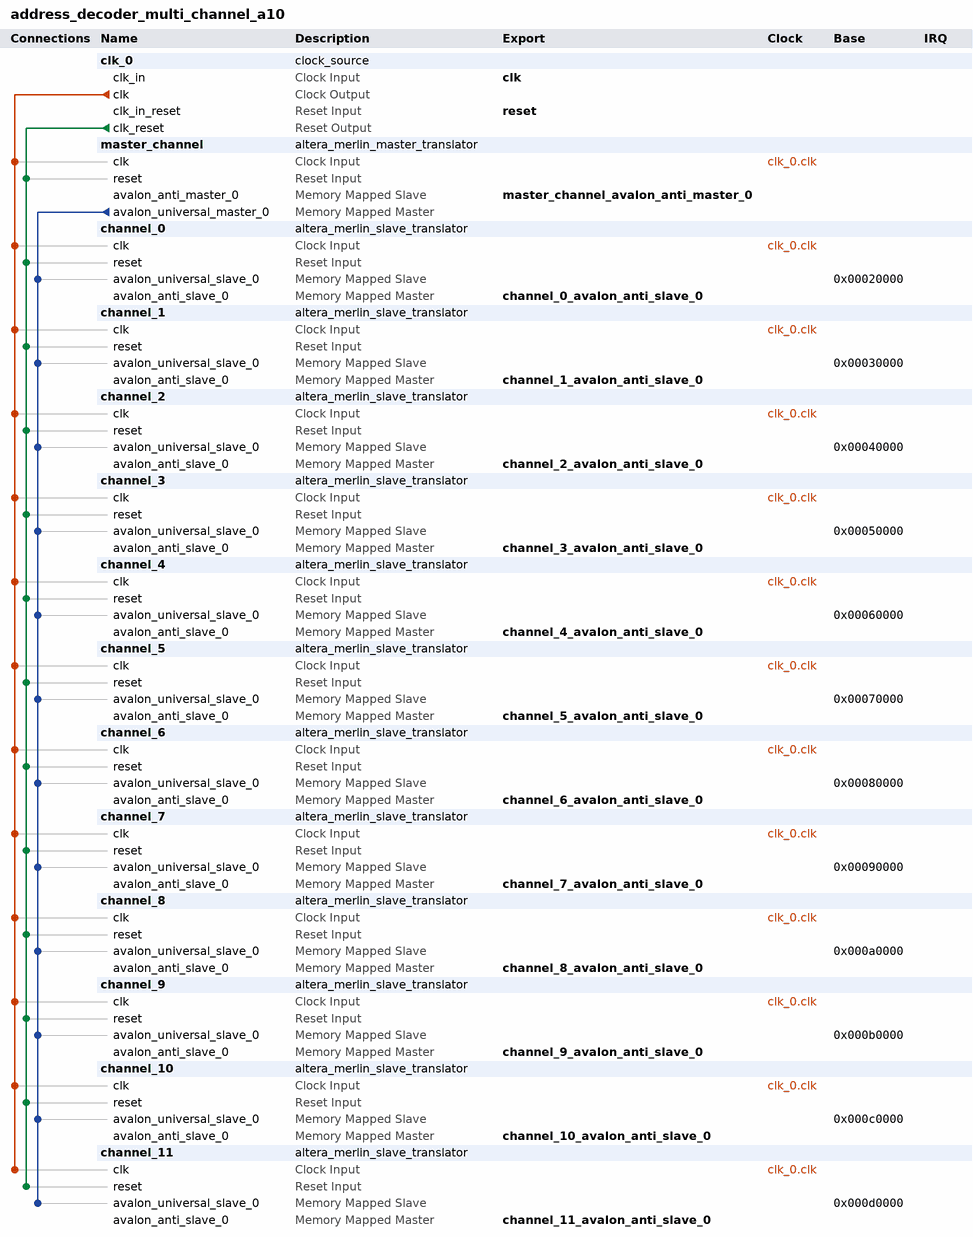
[diagram p0: system contents]
# Platform Designer (Qsys) system address_decoder_multi_channel_a10, Arria 10 10AX115S4F45I3SGE2
# Parameters at their usual value, and those the tool derives, are not listed.
package require -exact qsys 15.0
create_system address_decoder_multi_channel_a10
set_project_property DEVICE_FAMILY {Arria 10}
set_project_property DEVICE 10AX115S4F45I3SGE2

add_instance clk_0 clock_source 15.0
set_instance_parameter_value clk_0 clockFrequency 100000000

add_instance master_channel altera_merlin_master_translator 15.0
set_instance_parameter_value master_channel AV_ADDRESSGROUP 0
set_instance_parameter_value master_channel AV_ADDRESS_SYMBOLS 1
set_instance_parameter_value master_channel AV_ADDRESS_W 20
set_instance_parameter_value master_channel AV_ALWAYSBURSTMAXBURST 0
set_instance_parameter_value master_channel AV_BITS_PER_SYMBOL 8
set_instance_parameter_value master_channel AV_BURSTBOUNDARIES 0
set_instance_parameter_value master_channel AV_BURSTCOUNT_SYMBOLS 1
set_instance_parameter_value master_channel AV_BURSTCOUNT_W 3
set_instance_parameter_value master_channel AV_BYTEENABLE_W 4
set_instance_parameter_value master_channel AV_CONSTANT_BURST_BEHAVIOR 0
set_instance_parameter_value master_channel AV_DATA_HOLD 0
set_instance_parameter_value master_channel AV_DATA_W 32
set_instance_parameter_value master_channel AV_INTERLEAVEBURSTS 0
set_instance_parameter_value master_channel AV_ISBIGENDIAN 0
set_instance_parameter_value master_channel AV_LINEWRAPBURSTS 0
set_instance_parameter_value master_channel AV_MAX_PENDING_READ_TRANSACTIONS 0
set_instance_parameter_value master_channel AV_READLATENCY 0
set_instance_parameter_value master_channel AV_READ_WAIT 0
set_instance_parameter_value master_channel AV_REGISTERINCOMINGSIGNALS 0
set_instance_parameter_value master_channel AV_REGISTEROUTGOINGSIGNALS 0
set_instance_parameter_value master_channel AV_SETUP_WAIT 0
set_instance_parameter_value master_channel AV_SYMBOLS_PER_WORD 4
set_instance_parameter_value master_channel AV_WRITE_WAIT 0
set_instance_parameter_value master_channel UAV_ADDRESSGROUP 0
set_instance_parameter_value master_channel UAV_ADDRESS_W 32
set_instance_parameter_value master_channel UAV_BURSTCOUNT_W 3
set_instance_parameter_value master_channel UAV_CONSTANT_BURST_BEHAVIOR 0
set_instance_parameter_value master_channel USE_ADDRESS 1
set_instance_parameter_value master_channel USE_BEGINBURSTTRANSFER 0
set_instance_parameter_value master_channel USE_BEGINTRANSFER 0
set_instance_parameter_value master_channel USE_BURSTCOUNT 0
set_instance_parameter_value master_channel USE_BYTEENABLE 0
set_instance_parameter_value master_channel USE_CHIPSELECT 0
set_instance_parameter_value master_channel USE_CLKEN 0
set_instance_parameter_value master_channel USE_DEBUGACCESS 0
set_instance_parameter_value master_channel USE_LOCK 0
set_instance_parameter_value master_channel USE_READ 1
set_instance_parameter_value master_channel USE_READDATA 1
set_instance_parameter_value master_channel USE_READDATAVALID 0
set_instance_parameter_value master_channel USE_READRESPONSE 0
set_instance_parameter_value master_channel USE_WAITREQUEST 1
set_instance_parameter_value master_channel USE_WRITE 1
set_instance_parameter_value master_channel USE_WRITEDATA 1
set_instance_parameter_value master_channel USE_WRITERESPONSE 0

add_instance channel_0 altera_merlin_slave_translator 15.0
set_instance_parameter_value channel_0 AV_ADDRESSGROUP 0
set_instance_parameter_value channel_0 AV_ADDRESS_SYMBOLS 1
set_instance_parameter_value channel_0 AV_ADDRESS_W 16
set_instance_parameter_value channel_0 AV_ALWAYSBURSTMAXBURST 0
set_instance_parameter_value channel_0 AV_BITS_PER_SYMBOL 8
set_instance_parameter_value channel_0 AV_BURSTBOUNDARIES 0
set_instance_parameter_value channel_0 AV_BURSTCOUNT_SYMBOLS 1
set_instance_parameter_value channel_0 AV_BURSTCOUNT_W 1
set_instance_parameter_value channel_0 AV_BYTEENABLE_W 4
set_instance_parameter_value channel_0 AV_CONSTANT_BURST_BEHAVIOR 0
set_instance_parameter_value channel_0 AV_DATA_HOLD 0
set_instance_parameter_value channel_0 AV_DATA_W 32
set_instance_parameter_value channel_0 AV_INTERLEAVEBURSTS 0
set_instance_parameter_value channel_0 AV_ISBIGENDIAN 0
set_instance_parameter_value channel_0 AV_LINEWRAPBURSTS 0
set_instance_parameter_value channel_0 AV_MAX_PENDING_READ_TRANSACTIONS 1
set_instance_parameter_value channel_0 AV_MAX_PENDING_WRITE_TRANSACTIONS 0
set_instance_parameter_value channel_0 AV_READLATENCY 0
set_instance_parameter_value channel_0 AV_READ_WAIT 0
set_instance_parameter_value channel_0 AV_REGISTERINCOMINGSIGNALS 0
set_instance_parameter_value channel_0 AV_REGISTEROUTGOINGSIGNALS 0
set_instance_parameter_value channel_0 AV_REQUIRE_UNALIGNED_ADDRESSES 0
set_instance_parameter_value channel_0 AV_SETUP_WAIT 0
set_instance_parameter_value channel_0 AV_SYMBOLS_PER_WORD 4
set_instance_parameter_value channel_0 AV_TIMING_UNITS 1
set_instance_parameter_value channel_0 AV_WRITE_WAIT 0
set_instance_parameter_value channel_0 CHIPSELECT_THROUGH_READLATENCY 0
set_instance_parameter_value channel_0 CLOCK_RATE 100000000
set_instance_parameter_value channel_0 UAV_ADDRESSGROUP 0
set_instance_parameter_value channel_0 UAV_ADDRESS_W 16
set_instance_parameter_value channel_0 UAV_BURSTCOUNT_W 3
set_instance_parameter_value channel_0 UAV_BYTEENABLE_W 4
set_instance_parameter_value channel_0 UAV_CONSTANT_BURST_BEHAVIOR 0
set_instance_parameter_value channel_0 UAV_DATA_W 32
set_instance_parameter_value channel_0 USE_ADDRESS 1
set_instance_parameter_value channel_0 USE_AV_CLKEN 0
set_instance_parameter_value channel_0 USE_BEGINBURSTTRANSFER 0
set_instance_parameter_value channel_0 USE_BEGINTRANSFER 0
set_instance_parameter_value channel_0 USE_BURSTCOUNT 0
set_instance_parameter_value channel_0 USE_BYTEENABLE 0
set_instance_parameter_value channel_0 USE_CHIPSELECT 0
set_instance_parameter_value channel_0 USE_DEBUGACCESS 0
set_instance_parameter_value channel_0 USE_LOCK 0
set_instance_parameter_value channel_0 USE_OUTPUTENABLE 0
set_instance_parameter_value channel_0 USE_READ 1
set_instance_parameter_value channel_0 USE_READDATA 1
set_instance_parameter_value channel_0 USE_READDATAVALID 0
set_instance_parameter_value channel_0 USE_READRESPONSE 0
set_instance_parameter_value channel_0 USE_UAV_CLKEN 0
set_instance_parameter_value channel_0 USE_WAITREQUEST 1
set_instance_parameter_value channel_0 USE_WRITE 1
set_instance_parameter_value channel_0 USE_WRITEBYTEENABLE 0
set_instance_parameter_value channel_0 USE_WRITEDATA 1
set_instance_parameter_value channel_0 USE_WRITERESPONSE 0

add_instance channel_1 altera_merlin_slave_translator 15.0
set_instance_parameter_value channel_1 AV_ADDRESSGROUP 0
set_instance_parameter_value channel_1 AV_ADDRESS_SYMBOLS 1
set_instance_parameter_value channel_1 AV_ADDRESS_W 16
set_instance_parameter_value channel_1 AV_ALWAYSBURSTMAXBURST 0
set_instance_parameter_value channel_1 AV_BITS_PER_SYMBOL 8
set_instance_parameter_value channel_1 AV_BURSTBOUNDARIES 0
set_instance_parameter_value channel_1 AV_BURSTCOUNT_SYMBOLS 1
set_instance_parameter_value channel_1 AV_BURSTCOUNT_W 1
set_instance_parameter_value channel_1 AV_BYTEENABLE_W 4
set_instance_parameter_value channel_1 AV_CONSTANT_BURST_BEHAVIOR 0
set_instance_parameter_value channel_1 AV_DATA_HOLD 0
set_instance_parameter_value channel_1 AV_DATA_W 32
set_instance_parameter_value channel_1 AV_INTERLEAVEBURSTS 0
set_instance_parameter_value channel_1 AV_ISBIGENDIAN 0
set_instance_parameter_value channel_1 AV_LINEWRAPBURSTS 0
set_instance_parameter_value channel_1 AV_MAX_PENDING_READ_TRANSACTIONS 1
set_instance_parameter_value channel_1 AV_MAX_PENDING_WRITE_TRANSACTIONS 0
set_instance_parameter_value channel_1 AV_READLATENCY 0
set_instance_parameter_value channel_1 AV_READ_WAIT 0
set_instance_parameter_value channel_1 AV_REGISTERINCOMINGSIGNALS 0
set_instance_parameter_value channel_1 AV_REGISTEROUTGOINGSIGNALS 0
set_instance_parameter_value channel_1 AV_REQUIRE_UNALIGNED_ADDRESSES 0
set_instance_parameter_value channel_1 AV_SETUP_WAIT 0
set_instance_parameter_value channel_1 AV_SYMBOLS_PER_WORD 4
set_instance_parameter_value channel_1 AV_TIMING_UNITS 1
set_instance_parameter_value channel_1 AV_WRITE_WAIT 0
set_instance_parameter_value channel_1 CHIPSELECT_THROUGH_READLATENCY 0
set_instance_parameter_value channel_1 CLOCK_RATE 100000000
set_instance_parameter_value channel_1 UAV_ADDRESSGROUP 0
set_instance_parameter_value channel_1 UAV_ADDRESS_W 16
set_instance_parameter_value channel_1 UAV_BURSTCOUNT_W 3
set_instance_parameter_value channel_1 UAV_BYTEENABLE_W 4
set_instance_parameter_value channel_1 UAV_CONSTANT_BURST_BEHAVIOR 0
set_instance_parameter_value channel_1 UAV_DATA_W 32
set_instance_parameter_value channel_1 USE_ADDRESS 1
set_instance_parameter_value channel_1 USE_AV_CLKEN 0
set_instance_parameter_value channel_1 USE_BEGINBURSTTRANSFER 0
set_instance_parameter_value channel_1 USE_BEGINTRANSFER 0
set_instance_parameter_value channel_1 USE_BURSTCOUNT 0
set_instance_parameter_value channel_1 USE_BYTEENABLE 0
set_instance_parameter_value channel_1 USE_CHIPSELECT 0
set_instance_parameter_value channel_1 USE_DEBUGACCESS 0
set_instance_parameter_value channel_1 USE_LOCK 0
set_instance_parameter_value channel_1 USE_OUTPUTENABLE 0
set_instance_parameter_value channel_1 USE_READ 1
set_instance_parameter_value channel_1 USE_READDATA 1
set_instance_parameter_value channel_1 USE_READDATAVALID 0
set_instance_parameter_value channel_1 USE_READRESPONSE 0
set_instance_parameter_value channel_1 USE_UAV_CLKEN 0
set_instance_parameter_value channel_1 USE_WAITREQUEST 1
set_instance_parameter_value channel_1 USE_WRITE 1
set_instance_parameter_value channel_1 USE_WRITEBYTEENABLE 0
set_instance_parameter_value channel_1 USE_WRITEDATA 1
set_instance_parameter_value channel_1 USE_WRITERESPONSE 0

add_instance channel_2 altera_merlin_slave_translator 15.0
set_instance_parameter_value channel_2 AV_ADDRESSGROUP 0
set_instance_parameter_value channel_2 AV_ADDRESS_SYMBOLS 1
set_instance_parameter_value channel_2 AV_ADDRESS_W 16
set_instance_parameter_value channel_2 AV_ALWAYSBURSTMAXBURST 0
set_instance_parameter_value channel_2 AV_BITS_PER_SYMBOL 8
set_instance_parameter_value channel_2 AV_BURSTBOUNDARIES 0
set_instance_parameter_value channel_2 AV_BURSTCOUNT_SYMBOLS 1
set_instance_parameter_value channel_2 AV_BURSTCOUNT_W 1
set_instance_parameter_value channel_2 AV_BYTEENABLE_W 4
set_instance_parameter_value channel_2 AV_CONSTANT_BURST_BEHAVIOR 0
set_instance_parameter_value channel_2 AV_DATA_HOLD 0
set_instance_parameter_value channel_2 AV_DATA_W 32
set_instance_parameter_value channel_2 AV_INTERLEAVEBURSTS 0
set_instance_parameter_value channel_2 AV_ISBIGENDIAN 0
set_instance_parameter_value channel_2 AV_LINEWRAPBURSTS 0
set_instance_parameter_value channel_2 AV_MAX_PENDING_READ_TRANSACTIONS 1
set_instance_parameter_value channel_2 AV_MAX_PENDING_WRITE_TRANSACTIONS 0
set_instance_parameter_value channel_2 AV_READLATENCY 0
set_instance_parameter_value channel_2 AV_READ_WAIT 0
set_instance_parameter_value channel_2 AV_REGISTERINCOMINGSIGNALS 0
set_instance_parameter_value channel_2 AV_REGISTEROUTGOINGSIGNALS 0
set_instance_parameter_value channel_2 AV_REQUIRE_UNALIGNED_ADDRESSES 0
set_instance_parameter_value channel_2 AV_SETUP_WAIT 0
set_instance_parameter_value channel_2 AV_SYMBOLS_PER_WORD 4
set_instance_parameter_value channel_2 AV_TIMING_UNITS 1
set_instance_parameter_value channel_2 AV_WRITE_WAIT 0
set_instance_parameter_value channel_2 CHIPSELECT_THROUGH_READLATENCY 0
set_instance_parameter_value channel_2 CLOCK_RATE 100000000
set_instance_parameter_value channel_2 UAV_ADDRESSGROUP 0
set_instance_parameter_value channel_2 UAV_ADDRESS_W 16
set_instance_parameter_value channel_2 UAV_BURSTCOUNT_W 3
set_instance_parameter_value channel_2 UAV_BYTEENABLE_W 4
set_instance_parameter_value channel_2 UAV_CONSTANT_BURST_BEHAVIOR 0
set_instance_parameter_value channel_2 UAV_DATA_W 32
set_instance_parameter_value channel_2 USE_ADDRESS 1
set_instance_parameter_value channel_2 USE_AV_CLKEN 0
set_instance_parameter_value channel_2 USE_BEGINBURSTTRANSFER 0
set_instance_parameter_value channel_2 USE_BEGINTRANSFER 0
set_instance_parameter_value channel_2 USE_BURSTCOUNT 0
set_instance_parameter_value channel_2 USE_BYTEENABLE 0
set_instance_parameter_value channel_2 USE_CHIPSELECT 0
set_instance_parameter_value channel_2 USE_DEBUGACCESS 0
set_instance_parameter_value channel_2 USE_LOCK 0
set_instance_parameter_value channel_2 USE_OUTPUTENABLE 0
set_instance_parameter_value channel_2 USE_READ 1
set_instance_parameter_value channel_2 USE_READDATA 1
set_instance_parameter_value channel_2 USE_READDATAVALID 0
set_instance_parameter_value channel_2 USE_READRESPONSE 0
set_instance_parameter_value channel_2 USE_UAV_CLKEN 0
set_instance_parameter_value channel_2 USE_WAITREQUEST 1
set_instance_parameter_value channel_2 USE_WRITE 1
set_instance_parameter_value channel_2 USE_WRITEBYTEENABLE 0
set_instance_parameter_value channel_2 USE_WRITEDATA 1
set_instance_parameter_value channel_2 USE_WRITERESPONSE 0

add_instance channel_3 altera_merlin_slave_translator 15.0
set_instance_parameter_value channel_3 AV_ADDRESSGROUP 0
set_instance_parameter_value channel_3 AV_ADDRESS_SYMBOLS 1
set_instance_parameter_value channel_3 AV_ADDRESS_W 16
set_instance_parameter_value channel_3 AV_ALWAYSBURSTMAXBURST 0
set_instance_parameter_value channel_3 AV_BITS_PER_SYMBOL 8
set_instance_parameter_value channel_3 AV_BURSTBOUNDARIES 0
set_instance_parameter_value channel_3 AV_BURSTCOUNT_SYMBOLS 1
set_instance_parameter_value channel_3 AV_BURSTCOUNT_W 1
set_instance_parameter_value channel_3 AV_BYTEENABLE_W 4
set_instance_parameter_value channel_3 AV_CONSTANT_BURST_BEHAVIOR 0
set_instance_parameter_value channel_3 AV_DATA_HOLD 0
set_instance_parameter_value channel_3 AV_DATA_W 32
set_instance_parameter_value channel_3 AV_INTERLEAVEBURSTS 0
set_instance_parameter_value channel_3 AV_ISBIGENDIAN 0
set_instance_parameter_value channel_3 AV_LINEWRAPBURSTS 0
set_instance_parameter_value channel_3 AV_MAX_PENDING_READ_TRANSACTIONS 1
set_instance_parameter_value channel_3 AV_MAX_PENDING_WRITE_TRANSACTIONS 0
set_instance_parameter_value channel_3 AV_READLATENCY 0
set_instance_parameter_value channel_3 AV_READ_WAIT 0
set_instance_parameter_value channel_3 AV_REGISTERINCOMINGSIGNALS 0
set_instance_parameter_value channel_3 AV_REGISTEROUTGOINGSIGNALS 0
set_instance_parameter_value channel_3 AV_REQUIRE_UNALIGNED_ADDRESSES 0
set_instance_parameter_value channel_3 AV_SETUP_WAIT 0
set_instance_parameter_value channel_3 AV_SYMBOLS_PER_WORD 4
set_instance_parameter_value channel_3 AV_TIMING_UNITS 1
set_instance_parameter_value channel_3 AV_WRITE_WAIT 0
set_instance_parameter_value channel_3 CHIPSELECT_THROUGH_READLATENCY 0
set_instance_parameter_value channel_3 CLOCK_RATE 100000000
set_instance_parameter_value channel_3 UAV_ADDRESSGROUP 0
set_instance_parameter_value channel_3 UAV_ADDRESS_W 16
set_instance_parameter_value channel_3 UAV_BURSTCOUNT_W 3
set_instance_parameter_value channel_3 UAV_BYTEENABLE_W 4
set_instance_parameter_value channel_3 UAV_CONSTANT_BURST_BEHAVIOR 0
set_instance_parameter_value channel_3 UAV_DATA_W 32
set_instance_parameter_value channel_3 USE_ADDRESS 1
set_instance_parameter_value channel_3 USE_AV_CLKEN 0
set_instance_parameter_value channel_3 USE_BEGINBURSTTRANSFER 0
set_instance_parameter_value channel_3 USE_BEGINTRANSFER 0
set_instance_parameter_value channel_3 USE_BURSTCOUNT 0
set_instance_parameter_value channel_3 USE_BYTEENABLE 0
set_instance_parameter_value channel_3 USE_CHIPSELECT 0
set_instance_parameter_value channel_3 USE_DEBUGACCESS 0
set_instance_parameter_value channel_3 USE_LOCK 0
set_instance_parameter_value channel_3 USE_OUTPUTENABLE 0
set_instance_parameter_value channel_3 USE_READ 1
set_instance_parameter_value channel_3 USE_READDATA 1
set_instance_parameter_value channel_3 USE_READDATAVALID 0
set_instance_parameter_value channel_3 USE_READRESPONSE 0
set_instance_parameter_value channel_3 USE_UAV_CLKEN 0
set_instance_parameter_value channel_3 USE_WAITREQUEST 1
set_instance_parameter_value channel_3 USE_WRITE 1
set_instance_parameter_value channel_3 USE_WRITEBYTEENABLE 0
set_instance_parameter_value channel_3 USE_WRITEDATA 1
set_instance_parameter_value channel_3 USE_WRITERESPONSE 0

add_instance channel_4 altera_merlin_slave_translator 15.0
set_instance_parameter_value channel_4 AV_ADDRESSGROUP 0
set_instance_parameter_value channel_4 AV_ADDRESS_SYMBOLS 1
set_instance_parameter_value channel_4 AV_ADDRESS_W 16
set_instance_parameter_value channel_4 AV_ALWAYSBURSTMAXBURST 0
set_instance_parameter_value channel_4 AV_BITS_PER_SYMBOL 8
set_instance_parameter_value channel_4 AV_BURSTBOUNDARIES 0
set_instance_parameter_value channel_4 AV_BURSTCOUNT_SYMBOLS 1
set_instance_parameter_value channel_4 AV_BURSTCOUNT_W 1
set_instance_parameter_value channel_4 AV_BYTEENABLE_W 4
set_instance_parameter_value channel_4 AV_CONSTANT_BURST_BEHAVIOR 0
set_instance_parameter_value channel_4 AV_DATA_HOLD 0
set_instance_parameter_value channel_4 AV_DATA_W 32
set_instance_parameter_value channel_4 AV_INTERLEAVEBURSTS 0
set_instance_parameter_value channel_4 AV_ISBIGENDIAN 0
set_instance_parameter_value channel_4 AV_LINEWRAPBURSTS 0
set_instance_parameter_value channel_4 AV_MAX_PENDING_READ_TRANSACTIONS 1
set_instance_parameter_value channel_4 AV_MAX_PENDING_WRITE_TRANSACTIONS 0
set_instance_parameter_value channel_4 AV_READLATENCY 0
set_instance_parameter_value channel_4 AV_READ_WAIT 0
set_instance_parameter_value channel_4 AV_REGISTERINCOMINGSIGNALS 0
set_instance_parameter_value channel_4 AV_REGISTEROUTGOINGSIGNALS 0
set_instance_parameter_value channel_4 AV_REQUIRE_UNALIGNED_ADDRESSES 0
set_instance_parameter_value channel_4 AV_SETUP_WAIT 0
set_instance_parameter_value channel_4 AV_SYMBOLS_PER_WORD 4
set_instance_parameter_value channel_4 AV_TIMING_UNITS 1
set_instance_parameter_value channel_4 AV_WRITE_WAIT 0
set_instance_parameter_value channel_4 CHIPSELECT_THROUGH_READLATENCY 0
set_instance_parameter_value channel_4 CLOCK_RATE 100000000
set_instance_parameter_value channel_4 UAV_ADDRESSGROUP 0
set_instance_parameter_value channel_4 UAV_ADDRESS_W 16
set_instance_parameter_value channel_4 UAV_BURSTCOUNT_W 3
set_instance_parameter_value channel_4 UAV_BYTEENABLE_W 4
set_instance_parameter_value channel_4 UAV_CONSTANT_BURST_BEHAVIOR 0
set_instance_parameter_value channel_4 UAV_DATA_W 32
set_instance_parameter_value channel_4 USE_ADDRESS 1
set_instance_parameter_value channel_4 USE_AV_CLKEN 0
set_instance_parameter_value channel_4 USE_BEGINBURSTTRANSFER 0
set_instance_parameter_value channel_4 USE_BEGINTRANSFER 0
set_instance_parameter_value channel_4 USE_BURSTCOUNT 0
set_instance_parameter_value channel_4 USE_BYTEENABLE 0
set_instance_parameter_value channel_4 USE_CHIPSELECT 0
set_instance_parameter_value channel_4 USE_DEBUGACCESS 0
set_instance_parameter_value channel_4 USE_LOCK 0
set_instance_parameter_value channel_4 USE_OUTPUTENABLE 0
set_instance_parameter_value channel_4 USE_READ 1
set_instance_parameter_value channel_4 USE_READDATA 1
set_instance_parameter_value channel_4 USE_READDATAVALID 0
set_instance_parameter_value channel_4 USE_READRESPONSE 0
set_instance_parameter_value channel_4 USE_UAV_CLKEN 0
set_instance_parameter_value channel_4 USE_WAITREQUEST 1
set_instance_parameter_value channel_4 USE_WRITE 1
set_instance_parameter_value channel_4 USE_WRITEBYTEENABLE 0
set_instance_parameter_value channel_4 USE_WRITEDATA 1
set_instance_parameter_value channel_4 USE_WRITERESPONSE 0

add_instance channel_5 altera_merlin_slave_translator 15.0
set_instance_parameter_value channel_5 AV_ADDRESSGROUP 0
set_instance_parameter_value channel_5 AV_ADDRESS_SYMBOLS 1
set_instance_parameter_value channel_5 AV_ADDRESS_W 16
set_instance_parameter_value channel_5 AV_ALWAYSBURSTMAXBURST 0
set_instance_parameter_value channel_5 AV_BITS_PER_SYMBOL 8
set_instance_parameter_value channel_5 AV_BURSTBOUNDARIES 0
set_instance_parameter_value channel_5 AV_BURSTCOUNT_SYMBOLS 1
set_instance_parameter_value channel_5 AV_BURSTCOUNT_W 1
set_instance_parameter_value channel_5 AV_BYTEENABLE_W 4
set_instance_parameter_value channel_5 AV_CONSTANT_BURST_BEHAVIOR 0
set_instance_parameter_value channel_5 AV_DATA_HOLD 0
set_instance_parameter_value channel_5 AV_DATA_W 32
set_instance_parameter_value channel_5 AV_INTERLEAVEBURSTS 0
set_instance_parameter_value channel_5 AV_ISBIGENDIAN 0
set_instance_parameter_value channel_5 AV_LINEWRAPBURSTS 0
set_instance_parameter_value channel_5 AV_MAX_PENDING_READ_TRANSACTIONS 1
set_instance_parameter_value channel_5 AV_MAX_PENDING_WRITE_TRANSACTIONS 0
set_instance_parameter_value channel_5 AV_READLATENCY 0
set_instance_parameter_value channel_5 AV_READ_WAIT 0
set_instance_parameter_value channel_5 AV_REGISTERINCOMINGSIGNALS 0
set_instance_parameter_value channel_5 AV_REGISTEROUTGOINGSIGNALS 0
set_instance_parameter_value channel_5 AV_REQUIRE_UNALIGNED_ADDRESSES 0
set_instance_parameter_value channel_5 AV_SETUP_WAIT 0
set_instance_parameter_value channel_5 AV_SYMBOLS_PER_WORD 4
set_instance_parameter_value channel_5 AV_TIMING_UNITS 1
set_instance_parameter_value channel_5 AV_WRITE_WAIT 0
set_instance_parameter_value channel_5 CHIPSELECT_THROUGH_READLATENCY 0
set_instance_parameter_value channel_5 CLOCK_RATE 100000000
set_instance_parameter_value channel_5 UAV_ADDRESSGROUP 0
set_instance_parameter_value channel_5 UAV_ADDRESS_W 16
set_instance_parameter_value channel_5 UAV_BURSTCOUNT_W 3
set_instance_parameter_value channel_5 UAV_BYTEENABLE_W 4
set_instance_parameter_value channel_5 UAV_CONSTANT_BURST_BEHAVIOR 0
set_instance_parameter_value channel_5 UAV_DATA_W 32
set_instance_parameter_value channel_5 USE_ADDRESS 1
set_instance_parameter_value channel_5 USE_AV_CLKEN 0
set_instance_parameter_value channel_5 USE_BEGINBURSTTRANSFER 0
set_instance_parameter_value channel_5 USE_BEGINTRANSFER 0
set_instance_parameter_value channel_5 USE_BURSTCOUNT 0
set_instance_parameter_value channel_5 USE_BYTEENABLE 0
set_instance_parameter_value channel_5 USE_CHIPSELECT 0
set_instance_parameter_value channel_5 USE_DEBUGACCESS 0
set_instance_parameter_value channel_5 USE_LOCK 0
set_instance_parameter_value channel_5 USE_OUTPUTENABLE 0
set_instance_parameter_value channel_5 USE_READ 1
set_instance_parameter_value channel_5 USE_READDATA 1
set_instance_parameter_value channel_5 USE_READDATAVALID 0
set_instance_parameter_value channel_5 USE_READRESPONSE 0
set_instance_parameter_value channel_5 USE_UAV_CLKEN 0
set_instance_parameter_value channel_5 USE_WAITREQUEST 1
set_instance_parameter_value channel_5 USE_WRITE 1
set_instance_parameter_value channel_5 USE_WRITEBYTEENABLE 0
set_instance_parameter_value channel_5 USE_WRITEDATA 1
set_instance_parameter_value channel_5 USE_WRITERESPONSE 0

add_instance channel_6 altera_merlin_slave_translator 15.0
set_instance_parameter_value channel_6 AV_ADDRESSGROUP 0
set_instance_parameter_value channel_6 AV_ADDRESS_SYMBOLS 1
set_instance_parameter_value channel_6 AV_ADDRESS_W 16
set_instance_parameter_value channel_6 AV_ALWAYSBURSTMAXBURST 0
set_instance_parameter_value channel_6 AV_BITS_PER_SYMBOL 8
set_instance_parameter_value channel_6 AV_BURSTBOUNDARIES 0
set_instance_parameter_value channel_6 AV_BURSTCOUNT_SYMBOLS 1
set_instance_parameter_value channel_6 AV_BURSTCOUNT_W 1
set_instance_parameter_value channel_6 AV_BYTEENABLE_W 4
set_instance_parameter_value channel_6 AV_CONSTANT_BURST_BEHAVIOR 0
set_instance_parameter_value channel_6 AV_DATA_HOLD 0
set_instance_parameter_value channel_6 AV_DATA_W 32
set_instance_parameter_value channel_6 AV_INTERLEAVEBURSTS 0
set_instance_parameter_value channel_6 AV_ISBIGENDIAN 0
set_instance_parameter_value channel_6 AV_LINEWRAPBURSTS 0
set_instance_parameter_value channel_6 AV_MAX_PENDING_READ_TRANSACTIONS 1
set_instance_parameter_value channel_6 AV_MAX_PENDING_WRITE_TRANSACTIONS 0
set_instance_parameter_value channel_6 AV_READLATENCY 0
set_instance_parameter_value channel_6 AV_READ_WAIT 0
set_instance_parameter_value channel_6 AV_REGISTERINCOMINGSIGNALS 0
set_instance_parameter_value channel_6 AV_REGISTEROUTGOINGSIGNALS 0
set_instance_parameter_value channel_6 AV_REQUIRE_UNALIGNED_ADDRESSES 0
set_instance_parameter_value channel_6 AV_SETUP_WAIT 0
set_instance_parameter_value channel_6 AV_SYMBOLS_PER_WORD 4
set_instance_parameter_value channel_6 AV_TIMING_UNITS 1
set_instance_parameter_value channel_6 AV_WRITE_WAIT 0
set_instance_parameter_value channel_6 CHIPSELECT_THROUGH_READLATENCY 0
set_instance_parameter_value channel_6 CLOCK_RATE 100000000
set_instance_parameter_value channel_6 UAV_ADDRESSGROUP 0
set_instance_parameter_value channel_6 UAV_ADDRESS_W 16
set_instance_parameter_value channel_6 UAV_BURSTCOUNT_W 3
set_instance_parameter_value channel_6 UAV_BYTEENABLE_W 4
set_instance_parameter_value channel_6 UAV_CONSTANT_BURST_BEHAVIOR 0
set_instance_parameter_value channel_6 UAV_DATA_W 32
set_instance_parameter_value channel_6 USE_ADDRESS 1
set_instance_parameter_value channel_6 USE_AV_CLKEN 0
set_instance_parameter_value channel_6 USE_BEGINBURSTTRANSFER 0
set_instance_parameter_value channel_6 USE_BEGINTRANSFER 0
set_instance_parameter_value channel_6 USE_BURSTCOUNT 0
set_instance_parameter_value channel_6 USE_BYTEENABLE 0
set_instance_parameter_value channel_6 USE_CHIPSELECT 0
set_instance_parameter_value channel_6 USE_DEBUGACCESS 0
set_instance_parameter_value channel_6 USE_LOCK 0
set_instance_parameter_value channel_6 USE_OUTPUTENABLE 0
set_instance_parameter_value channel_6 USE_READ 1
set_instance_parameter_value channel_6 USE_READDATA 1
set_instance_parameter_value channel_6 USE_READDATAVALID 0
set_instance_parameter_value channel_6 USE_READRESPONSE 0
set_instance_parameter_value channel_6 USE_UAV_CLKEN 0
set_instance_parameter_value channel_6 USE_WAITREQUEST 1
set_instance_parameter_value channel_6 USE_WRITE 1
set_instance_parameter_value channel_6 USE_WRITEBYTEENABLE 0
set_instance_parameter_value channel_6 USE_WRITEDATA 1
set_instance_parameter_value channel_6 USE_WRITERESPONSE 0

add_instance channel_7 altera_merlin_slave_translator 15.0
set_instance_parameter_value channel_7 AV_ADDRESSGROUP 0
set_instance_parameter_value channel_7 AV_ADDRESS_SYMBOLS 1
set_instance_parameter_value channel_7 AV_ADDRESS_W 16
set_instance_parameter_value channel_7 AV_ALWAYSBURSTMAXBURST 0
set_instance_parameter_value channel_7 AV_BITS_PER_SYMBOL 8
set_instance_parameter_value channel_7 AV_BURSTBOUNDARIES 0
set_instance_parameter_value channel_7 AV_BURSTCOUNT_SYMBOLS 1
set_instance_parameter_value channel_7 AV_BURSTCOUNT_W 1
set_instance_parameter_value channel_7 AV_BYTEENABLE_W 4
set_instance_parameter_value channel_7 AV_CONSTANT_BURST_BEHAVIOR 0
set_instance_parameter_value channel_7 AV_DATA_HOLD 0
set_instance_parameter_value channel_7 AV_DATA_W 32
set_instance_parameter_value channel_7 AV_INTERLEAVEBURSTS 0
set_instance_parameter_value channel_7 AV_ISBIGENDIAN 0
set_instance_parameter_value channel_7 AV_LINEWRAPBURSTS 0
set_instance_parameter_value channel_7 AV_MAX_PENDING_READ_TRANSACTIONS 1
set_instance_parameter_value channel_7 AV_MAX_PENDING_WRITE_TRANSACTIONS 0
set_instance_parameter_value channel_7 AV_READLATENCY 0
set_instance_parameter_value channel_7 AV_READ_WAIT 0
set_instance_parameter_value channel_7 AV_REGISTERINCOMINGSIGNALS 0
set_instance_parameter_value channel_7 AV_REGISTEROUTGOINGSIGNALS 0
set_instance_parameter_value channel_7 AV_REQUIRE_UNALIGNED_ADDRESSES 0
set_instance_parameter_value channel_7 AV_SETUP_WAIT 0
set_instance_parameter_value channel_7 AV_SYMBOLS_PER_WORD 4
set_instance_parameter_value channel_7 AV_TIMING_UNITS 1
set_instance_parameter_value channel_7 AV_WRITE_WAIT 0
set_instance_parameter_value channel_7 CHIPSELECT_THROUGH_READLATENCY 0
set_instance_parameter_value channel_7 CLOCK_RATE 100000000
set_instance_parameter_value channel_7 UAV_ADDRESSGROUP 0
set_instance_parameter_value channel_7 UAV_ADDRESS_W 16
set_instance_parameter_value channel_7 UAV_BURSTCOUNT_W 3
set_instance_parameter_value channel_7 UAV_BYTEENABLE_W 4
set_instance_parameter_value channel_7 UAV_CONSTANT_BURST_BEHAVIOR 0
set_instance_parameter_value channel_7 UAV_DATA_W 32
set_instance_parameter_value channel_7 USE_ADDRESS 1
set_instance_parameter_value channel_7 USE_AV_CLKEN 0
set_instance_parameter_value channel_7 USE_BEGINBURSTTRANSFER 0
set_instance_parameter_value channel_7 USE_BEGINTRANSFER 0
set_instance_parameter_value channel_7 USE_BURSTCOUNT 0
set_instance_parameter_value channel_7 USE_BYTEENABLE 0
set_instance_parameter_value channel_7 USE_CHIPSELECT 0
set_instance_parameter_value channel_7 USE_DEBUGACCESS 0
set_instance_parameter_value channel_7 USE_LOCK 0
set_instance_parameter_value channel_7 USE_OUTPUTENABLE 0
set_instance_parameter_value channel_7 USE_READ 1
set_instance_parameter_value channel_7 USE_READDATA 1
set_instance_parameter_value channel_7 USE_READDATAVALID 0
set_instance_parameter_value channel_7 USE_READRESPONSE 0
set_instance_parameter_value channel_7 USE_UAV_CLKEN 0
set_instance_parameter_value channel_7 USE_WAITREQUEST 1
set_instance_parameter_value channel_7 USE_WRITE 1
set_instance_parameter_value channel_7 USE_WRITEBYTEENABLE 0
set_instance_parameter_value channel_7 USE_WRITEDATA 1
set_instance_parameter_value channel_7 USE_WRITERESPONSE 0

add_instance channel_8 altera_merlin_slave_translator 15.0
set_instance_parameter_value channel_8 AV_ADDRESSGROUP 0
set_instance_parameter_value channel_8 AV_ADDRESS_SYMBOLS 1
set_instance_parameter_value channel_8 AV_ADDRESS_W 16
set_instance_parameter_value channel_8 AV_ALWAYSBURSTMAXBURST 0
set_instance_parameter_value channel_8 AV_BITS_PER_SYMBOL 8
set_instance_parameter_value channel_8 AV_BURSTBOUNDARIES 0
set_instance_parameter_value channel_8 AV_BURSTCOUNT_SYMBOLS 1
set_instance_parameter_value channel_8 AV_BURSTCOUNT_W 1
set_instance_parameter_value channel_8 AV_BYTEENABLE_W 4
set_instance_parameter_value channel_8 AV_CONSTANT_BURST_BEHAVIOR 0
set_instance_parameter_value channel_8 AV_DATA_HOLD 0
set_instance_parameter_value channel_8 AV_DATA_W 32
set_instance_parameter_value channel_8 AV_INTERLEAVEBURSTS 0
set_instance_parameter_value channel_8 AV_ISBIGENDIAN 0
set_instance_parameter_value channel_8 AV_LINEWRAPBURSTS 0
set_instance_parameter_value channel_8 AV_MAX_PENDING_READ_TRANSACTIONS 1
set_instance_parameter_value channel_8 AV_MAX_PENDING_WRITE_TRANSACTIONS 0
set_instance_parameter_value channel_8 AV_READLATENCY 0
set_instance_parameter_value channel_8 AV_READ_WAIT 0
set_instance_parameter_value channel_8 AV_REGISTERINCOMINGSIGNALS 0
set_instance_parameter_value channel_8 AV_REGISTEROUTGOINGSIGNALS 0
set_instance_parameter_value channel_8 AV_REQUIRE_UNALIGNED_ADDRESSES 0
set_instance_parameter_value channel_8 AV_SETUP_WAIT 0
set_instance_parameter_value channel_8 AV_SYMBOLS_PER_WORD 4
set_instance_parameter_value channel_8 AV_TIMING_UNITS 1
set_instance_parameter_value channel_8 AV_WRITE_WAIT 0
set_instance_parameter_value channel_8 CHIPSELECT_THROUGH_READLATENCY 0
set_instance_parameter_value channel_8 CLOCK_RATE 100000000
set_instance_parameter_value channel_8 UAV_ADDRESSGROUP 0
set_instance_parameter_value channel_8 UAV_ADDRESS_W 16
set_instance_parameter_value channel_8 UAV_BURSTCOUNT_W 3
set_instance_parameter_value channel_8 UAV_BYTEENABLE_W 4
set_instance_parameter_value channel_8 UAV_CONSTANT_BURST_BEHAVIOR 0
set_instance_parameter_value channel_8 UAV_DATA_W 32
set_instance_parameter_value channel_8 USE_ADDRESS 1
set_instance_parameter_value channel_8 USE_AV_CLKEN 0
set_instance_parameter_value channel_8 USE_BEGINBURSTTRANSFER 0
set_instance_parameter_value channel_8 USE_BEGINTRANSFER 0
set_instance_parameter_value channel_8 USE_BURSTCOUNT 0
set_instance_parameter_value channel_8 USE_BYTEENABLE 0
set_instance_parameter_value channel_8 USE_CHIPSELECT 0
set_instance_parameter_value channel_8 USE_DEBUGACCESS 0
set_instance_parameter_value channel_8 USE_LOCK 0
set_instance_parameter_value channel_8 USE_OUTPUTENABLE 0
set_instance_parameter_value channel_8 USE_READ 1
set_instance_parameter_value channel_8 USE_READDATA 1
set_instance_parameter_value channel_8 USE_READDATAVALID 0
set_instance_parameter_value channel_8 USE_READRESPONSE 0
set_instance_parameter_value channel_8 USE_UAV_CLKEN 0
set_instance_parameter_value channel_8 USE_WAITREQUEST 1
set_instance_parameter_value channel_8 USE_WRITE 1
set_instance_parameter_value channel_8 USE_WRITEBYTEENABLE 0
set_instance_parameter_value channel_8 USE_WRITEDATA 1
set_instance_parameter_value channel_8 USE_WRITERESPONSE 0

add_instance channel_9 altera_merlin_slave_translator 15.0
set_instance_parameter_value channel_9 AV_ADDRESSGROUP 0
set_instance_parameter_value channel_9 AV_ADDRESS_SYMBOLS 1
set_instance_parameter_value channel_9 AV_ADDRESS_W 16
set_instance_parameter_value channel_9 AV_ALWAYSBURSTMAXBURST 0
set_instance_parameter_value channel_9 AV_BITS_PER_SYMBOL 8
set_instance_parameter_value channel_9 AV_BURSTBOUNDARIES 0
set_instance_parameter_value channel_9 AV_BURSTCOUNT_SYMBOLS 1
set_instance_parameter_value channel_9 AV_BURSTCOUNT_W 1
set_instance_parameter_value channel_9 AV_BYTEENABLE_W 4
set_instance_parameter_value channel_9 AV_CONSTANT_BURST_BEHAVIOR 0
set_instance_parameter_value channel_9 AV_DATA_HOLD 0
set_instance_parameter_value channel_9 AV_DATA_W 32
set_instance_parameter_value channel_9 AV_INTERLEAVEBURSTS 0
set_instance_parameter_value channel_9 AV_ISBIGENDIAN 0
set_instance_parameter_value channel_9 AV_LINEWRAPBURSTS 0
set_instance_parameter_value channel_9 AV_MAX_PENDING_READ_TRANSACTIONS 1
set_instance_parameter_value channel_9 AV_MAX_PENDING_WRITE_TRANSACTIONS 0
set_instance_parameter_value channel_9 AV_READLATENCY 0
set_instance_parameter_value channel_9 AV_READ_WAIT 0
set_instance_parameter_value channel_9 AV_REGISTERINCOMINGSIGNALS 0
set_instance_parameter_value channel_9 AV_REGISTEROUTGOINGSIGNALS 0
set_instance_parameter_value channel_9 AV_REQUIRE_UNALIGNED_ADDRESSES 0
set_instance_parameter_value channel_9 AV_SETUP_WAIT 0
set_instance_parameter_value channel_9 AV_SYMBOLS_PER_WORD 4
set_instance_parameter_value channel_9 AV_TIMING_UNITS 1
set_instance_parameter_value channel_9 AV_WRITE_WAIT 0
set_instance_parameter_value channel_9 CHIPSELECT_THROUGH_READLATENCY 0
set_instance_parameter_value channel_9 CLOCK_RATE 100000000
set_instance_parameter_value channel_9 UAV_ADDRESSGROUP 0
set_instance_parameter_value channel_9 UAV_ADDRESS_W 16
set_instance_parameter_value channel_9 UAV_BURSTCOUNT_W 3
set_instance_parameter_value channel_9 UAV_BYTEENABLE_W 4
set_instance_parameter_value channel_9 UAV_CONSTANT_BURST_BEHAVIOR 0
set_instance_parameter_value channel_9 UAV_DATA_W 32
set_instance_parameter_value channel_9 USE_ADDRESS 1
set_instance_parameter_value channel_9 USE_AV_CLKEN 0
set_instance_parameter_value channel_9 USE_BEGINBURSTTRANSFER 0
set_instance_parameter_value channel_9 USE_BEGINTRANSFER 0
set_instance_parameter_value channel_9 USE_BURSTCOUNT 0
set_instance_parameter_value channel_9 USE_BYTEENABLE 0
set_instance_parameter_value channel_9 USE_CHIPSELECT 0
set_instance_parameter_value channel_9 USE_DEBUGACCESS 0
set_instance_parameter_value channel_9 USE_LOCK 0
set_instance_parameter_value channel_9 USE_OUTPUTENABLE 0
set_instance_parameter_value channel_9 USE_READ 1
set_instance_parameter_value channel_9 USE_READDATA 1
set_instance_parameter_value channel_9 USE_READDATAVALID 0
set_instance_parameter_value channel_9 USE_READRESPONSE 0
set_instance_parameter_value channel_9 USE_UAV_CLKEN 0
set_instance_parameter_value channel_9 USE_WAITREQUEST 1
set_instance_parameter_value channel_9 USE_WRITE 1
set_instance_parameter_value channel_9 USE_WRITEBYTEENABLE 0
set_instance_parameter_value channel_9 USE_WRITEDATA 1
set_instance_parameter_value channel_9 USE_WRITERESPONSE 0

add_instance channel_10 altera_merlin_slave_translator 15.0
set_instance_parameter_value channel_10 AV_ADDRESSGROUP 0
set_instance_parameter_value channel_10 AV_ADDRESS_SYMBOLS 1
set_instance_parameter_value channel_10 AV_ADDRESS_W 16
set_instance_parameter_value channel_10 AV_ALWAYSBURSTMAXBURST 0
set_instance_parameter_value channel_10 AV_BITS_PER_SYMBOL 8
set_instance_parameter_value channel_10 AV_BURSTBOUNDARIES 0
set_instance_parameter_value channel_10 AV_BURSTCOUNT_SYMBOLS 1
set_instance_parameter_value channel_10 AV_BURSTCOUNT_W 1
set_instance_parameter_value channel_10 AV_BYTEENABLE_W 4
set_instance_parameter_value channel_10 AV_CONSTANT_BURST_BEHAVIOR 0
set_instance_parameter_value channel_10 AV_DATA_HOLD 0
set_instance_parameter_value channel_10 AV_DATA_W 32
set_instance_parameter_value channel_10 AV_INTERLEAVEBURSTS 0
set_instance_parameter_value channel_10 AV_ISBIGENDIAN 0
set_instance_parameter_value channel_10 AV_LINEWRAPBURSTS 0
set_instance_parameter_value channel_10 AV_MAX_PENDING_READ_TRANSACTIONS 1
set_instance_parameter_value channel_10 AV_MAX_PENDING_WRITE_TRANSACTIONS 0
set_instance_parameter_value channel_10 AV_READLATENCY 0
set_instance_parameter_value channel_10 AV_READ_WAIT 0
set_instance_parameter_value channel_10 AV_REGISTERINCOMINGSIGNALS 0
set_instance_parameter_value channel_10 AV_REGISTEROUTGOINGSIGNALS 0
set_instance_parameter_value channel_10 AV_REQUIRE_UNALIGNED_ADDRESSES 0
set_instance_parameter_value channel_10 AV_SETUP_WAIT 0
set_instance_parameter_value channel_10 AV_SYMBOLS_PER_WORD 4
set_instance_parameter_value channel_10 AV_TIMING_UNITS 1
set_instance_parameter_value channel_10 AV_WRITE_WAIT 0
set_instance_parameter_value channel_10 CHIPSELECT_THROUGH_READLATENCY 0
set_instance_parameter_value channel_10 CLOCK_RATE 100000000
set_instance_parameter_value channel_10 UAV_ADDRESSGROUP 0
set_instance_parameter_value channel_10 UAV_ADDRESS_W 16
set_instance_parameter_value channel_10 UAV_BURSTCOUNT_W 3
set_instance_parameter_value channel_10 UAV_BYTEENABLE_W 4
set_instance_parameter_value channel_10 UAV_CONSTANT_BURST_BEHAVIOR 0
set_instance_parameter_value channel_10 UAV_DATA_W 32
set_instance_parameter_value channel_10 USE_ADDRESS 1
set_instance_parameter_value channel_10 USE_AV_CLKEN 0
set_instance_parameter_value channel_10 USE_BEGINBURSTTRANSFER 0
set_instance_parameter_value channel_10 USE_BEGINTRANSFER 0
set_instance_parameter_value channel_10 USE_BURSTCOUNT 0
set_instance_parameter_value channel_10 USE_BYTEENABLE 0
set_instance_parameter_value channel_10 USE_CHIPSELECT 0
set_instance_parameter_value channel_10 USE_DEBUGACCESS 0
set_instance_parameter_value channel_10 USE_LOCK 0
set_instance_parameter_value channel_10 USE_OUTPUTENABLE 0
set_instance_parameter_value channel_10 USE_READ 1
set_instance_parameter_value channel_10 USE_READDATA 1
set_instance_parameter_value channel_10 USE_READDATAVALID 0
set_instance_parameter_value channel_10 USE_READRESPONSE 0
set_instance_parameter_value channel_10 USE_UAV_CLKEN 0
set_instance_parameter_value channel_10 USE_WAITREQUEST 1
set_instance_parameter_value channel_10 USE_WRITE 1
set_instance_parameter_value channel_10 USE_WRITEBYTEENABLE 0
set_instance_parameter_value channel_10 USE_WRITEDATA 1
set_instance_parameter_value channel_10 USE_WRITERESPONSE 0

add_instance channel_11 altera_merlin_slave_translator 15.0
set_instance_parameter_value channel_11 AV_ADDRESSGROUP 0
set_instance_parameter_value channel_11 AV_ADDRESS_SYMBOLS 1
set_instance_parameter_value channel_11 AV_ADDRESS_W 16
set_instance_parameter_value channel_11 AV_ALWAYSBURSTMAXBURST 0
set_instance_parameter_value channel_11 AV_BITS_PER_SYMBOL 8
set_instance_parameter_value channel_11 AV_BURSTBOUNDARIES 0
set_instance_parameter_value channel_11 AV_BURSTCOUNT_SYMBOLS 1
set_instance_parameter_value channel_11 AV_BURSTCOUNT_W 1
set_instance_parameter_value channel_11 AV_BYTEENABLE_W 4
set_instance_parameter_value channel_11 AV_CONSTANT_BURST_BEHAVIOR 0
set_instance_parameter_value channel_11 AV_DATA_HOLD 0
set_instance_parameter_value channel_11 AV_DATA_W 32
set_instance_parameter_value channel_11 AV_INTERLEAVEBURSTS 0
set_instance_parameter_value channel_11 AV_ISBIGENDIAN 0
set_instance_parameter_value channel_11 AV_LINEWRAPBURSTS 0
set_instance_parameter_value channel_11 AV_MAX_PENDING_READ_TRANSACTIONS 1
set_instance_parameter_value channel_11 AV_MAX_PENDING_WRITE_TRANSACTIONS 0
set_instance_parameter_value channel_11 AV_READLATENCY 0
set_instance_parameter_value channel_11 AV_READ_WAIT 0
set_instance_parameter_value channel_11 AV_REGISTERINCOMINGSIGNALS 0
set_instance_parameter_value channel_11 AV_REGISTEROUTGOINGSIGNALS 0
set_instance_parameter_value channel_11 AV_REQUIRE_UNALIGNED_ADDRESSES 0
set_instance_parameter_value channel_11 AV_SETUP_WAIT 0
set_instance_parameter_value channel_11 AV_SYMBOLS_PER_WORD 4
set_instance_parameter_value channel_11 AV_TIMING_UNITS 1
set_instance_parameter_value channel_11 AV_WRITE_WAIT 0
set_instance_parameter_value channel_11 CHIPSELECT_THROUGH_READLATENCY 0
set_instance_parameter_value channel_11 CLOCK_RATE 100000000
set_instance_parameter_value channel_11 UAV_ADDRESSGROUP 0
set_instance_parameter_value channel_11 UAV_ADDRESS_W 16
set_instance_parameter_value channel_11 UAV_BURSTCOUNT_W 3
set_instance_parameter_value channel_11 UAV_BYTEENABLE_W 4
set_instance_parameter_value channel_11 UAV_CONSTANT_BURST_BEHAVIOR 0
set_instance_parameter_value channel_11 UAV_DATA_W 32
set_instance_parameter_value channel_11 USE_ADDRESS 1
set_instance_parameter_value channel_11 USE_AV_CLKEN 0
set_instance_parameter_value channel_11 USE_BEGINBURSTTRANSFER 0
set_instance_parameter_value channel_11 USE_BEGINTRANSFER 0
set_instance_parameter_value channel_11 USE_BURSTCOUNT 0
set_instance_parameter_value channel_11 USE_BYTEENABLE 0
set_instance_parameter_value channel_11 USE_CHIPSELECT 0
set_instance_parameter_value channel_11 USE_DEBUGACCESS 0
set_instance_parameter_value channel_11 USE_LOCK 0
set_instance_parameter_value channel_11 USE_OUTPUTENABLE 0
set_instance_parameter_value channel_11 USE_READ 1
set_instance_parameter_value channel_11 USE_READDATA 1
set_instance_parameter_value channel_11 USE_READDATAVALID 0
set_instance_parameter_value channel_11 USE_READRESPONSE 0
set_instance_parameter_value channel_11 USE_UAV_CLKEN 0
set_instance_parameter_value channel_11 USE_WAITREQUEST 1
set_instance_parameter_value channel_11 USE_WRITE 1
set_instance_parameter_value channel_11 USE_WRITEBYTEENABLE 0
set_instance_parameter_value channel_11 USE_WRITEDATA 1
set_instance_parameter_value channel_11 USE_WRITERESPONSE 0

# connections
add_connection clk_0.clk channel_0.clk clock
add_connection clk_0.clk channel_1.clk clock
add_connection clk_0.clk channel_2.clk clock
add_connection clk_0.clk channel_3.clk clock
add_connection clk_0.clk channel_4.clk clock
add_connection clk_0.clk channel_5.clk clock
add_connection clk_0.clk channel_6.clk clock
add_connection clk_0.clk channel_7.clk clock
add_connection clk_0.clk channel_8.clk clock
add_connection clk_0.clk channel_9.clk clock
add_connection clk_0.clk channel_10.clk clock
add_connection clk_0.clk channel_11.clk clock
add_connection clk_0.clk master_channel.clk clock
add_connection clk_0.clk_reset channel_0.reset reset
add_connection clk_0.clk_reset channel_1.reset reset
add_connection clk_0.clk_reset channel_2.reset reset
add_connection clk_0.clk_reset channel_3.reset reset
add_connection clk_0.clk_reset channel_4.reset reset
add_connection clk_0.clk_reset channel_5.reset reset
add_connection clk_0.clk_reset channel_6.reset reset
add_connection clk_0.clk_reset channel_7.reset reset
add_connection clk_0.clk_reset channel_8.reset reset
add_connection clk_0.clk_reset channel_9.reset reset
add_connection clk_0.clk_reset channel_10.reset reset
add_connection clk_0.clk_reset channel_11.reset reset
add_connection clk_0.clk_reset master_channel.reset reset
add_connection master_channel.avalon_universal_master_0 channel_0.avalon_universal_slave_0 avalon
set_connection_parameter_value master_channel.avalon_universal_master_0/channel_0.avalon_universal_slave_0 baseAddress 0x00020000
add_connection master_channel.avalon_universal_master_0 channel_1.avalon_universal_slave_0 avalon
set_connection_parameter_value master_channel.avalon_universal_master_0/channel_1.avalon_universal_slave_0 baseAddress 0x00030000
add_connection master_channel.avalon_universal_master_0 channel_2.avalon_universal_slave_0 avalon
set_connection_parameter_value master_channel.avalon_universal_master_0/channel_2.avalon_universal_slave_0 baseAddress 0x00040000
add_connection master_channel.avalon_universal_master_0 channel_3.avalon_universal_slave_0 avalon
set_connection_parameter_value master_channel.avalon_universal_master_0/channel_3.avalon_universal_slave_0 baseAddress 0x00050000
add_connection master_channel.avalon_universal_master_0 channel_4.avalon_universal_slave_0 avalon
set_connection_parameter_value master_channel.avalon_universal_master_0/channel_4.avalon_universal_slave_0 baseAddress 0x00060000
add_connection master_channel.avalon_universal_master_0 channel_5.avalon_universal_slave_0 avalon
set_connection_parameter_value master_channel.avalon_universal_master_0/channel_5.avalon_universal_slave_0 baseAddress 0x00070000
add_connection master_channel.avalon_universal_master_0 channel_6.avalon_universal_slave_0 avalon
set_connection_parameter_value master_channel.avalon_universal_master_0/channel_6.avalon_universal_slave_0 baseAddress 0x00080000
add_connection master_channel.avalon_universal_master_0 channel_7.avalon_universal_slave_0 avalon
set_connection_parameter_value master_channel.avalon_universal_master_0/channel_7.avalon_universal_slave_0 baseAddress 0x00090000
add_connection master_channel.avalon_universal_master_0 channel_8.avalon_universal_slave_0 avalon
set_connection_parameter_value master_channel.avalon_universal_master_0/channel_8.avalon_universal_slave_0 baseAddress 0x000a0000
add_connection master_channel.avalon_universal_master_0 channel_9.avalon_universal_slave_0 avalon
set_connection_parameter_value master_channel.avalon_universal_master_0/channel_9.avalon_universal_slave_0 baseAddress 0x000b0000
add_connection master_channel.avalon_universal_master_0 channel_10.avalon_universal_slave_0 avalon
set_connection_parameter_value master_channel.avalon_universal_master_0/channel_10.avalon_universal_slave_0 baseAddress 0x000c0000
add_connection master_channel.avalon_universal_master_0 channel_11.avalon_universal_slave_0 avalon
set_connection_parameter_value master_channel.avalon_universal_master_0/channel_11.avalon_universal_slave_0 baseAddress 0x000d0000

# exported interfaces
add_interface channel_0_avalon_anti_slave_0 avalon master
set_interface_property channel_0_avalon_anti_slave_0 EXPORT_OF channel_0.avalon_anti_slave_0
add_interface channel_10_avalon_anti_slave_0 avalon master
set_interface_property channel_10_avalon_anti_slave_0 EXPORT_OF channel_10.avalon_anti_slave_0
add_interface channel_11_avalon_anti_slave_0 avalon master
set_interface_property channel_11_avalon_anti_slave_0 EXPORT_OF channel_11.avalon_anti_slave_0
add_interface channel_1_avalon_anti_slave_0 avalon master
set_interface_property channel_1_avalon_anti_slave_0 EXPORT_OF channel_1.avalon_anti_slave_0
add_interface channel_2_avalon_anti_slave_0 avalon master
set_interface_property channel_2_avalon_anti_slave_0 EXPORT_OF channel_2.avalon_anti_slave_0
add_interface channel_3_avalon_anti_slave_0 avalon master
set_interface_property channel_3_avalon_anti_slave_0 EXPORT_OF channel_3.avalon_anti_slave_0
add_interface channel_4_avalon_anti_slave_0 avalon master
set_interface_property channel_4_avalon_anti_slave_0 EXPORT_OF channel_4.avalon_anti_slave_0
add_interface channel_5_avalon_anti_slave_0 avalon master
set_interface_property channel_5_avalon_anti_slave_0 EXPORT_OF channel_5.avalon_anti_slave_0
add_interface channel_6_avalon_anti_slave_0 avalon master
set_interface_property channel_6_avalon_anti_slave_0 EXPORT_OF channel_6.avalon_anti_slave_0
add_interface channel_7_avalon_anti_slave_0 avalon master
set_interface_property channel_7_avalon_anti_slave_0 EXPORT_OF channel_7.avalon_anti_slave_0
add_interface channel_8_avalon_anti_slave_0 avalon master
set_interface_property channel_8_avalon_anti_slave_0 EXPORT_OF channel_8.avalon_anti_slave_0
add_interface channel_9_avalon_anti_slave_0 avalon master
set_interface_property channel_9_avalon_anti_slave_0 EXPORT_OF channel_9.avalon_anti_slave_0
add_interface clk clock sink
set_interface_property clk EXPORT_OF clk_0.clk_in
add_interface master_channel_avalon_anti_master_0 avalon slave
set_interface_property master_channel_avalon_anti_master_0 EXPORT_OF master_channel.avalon_anti_master_0
add_interface reset reset sink
set_interface_property reset EXPORT_OF clk_0.clk_in_reset

set_interconnect_requirement {$system} qsys_mm.clockCrossingAdapter HANDSHAKE
set_interconnect_requirement {$system} qsys_mm.maxAdditionalLatency 1

save_system address_decoder_multi_channel_a10.qsys
